# EAGLE design PCB-PAYLOAD_FINAL (EAGLE 7.6.0)
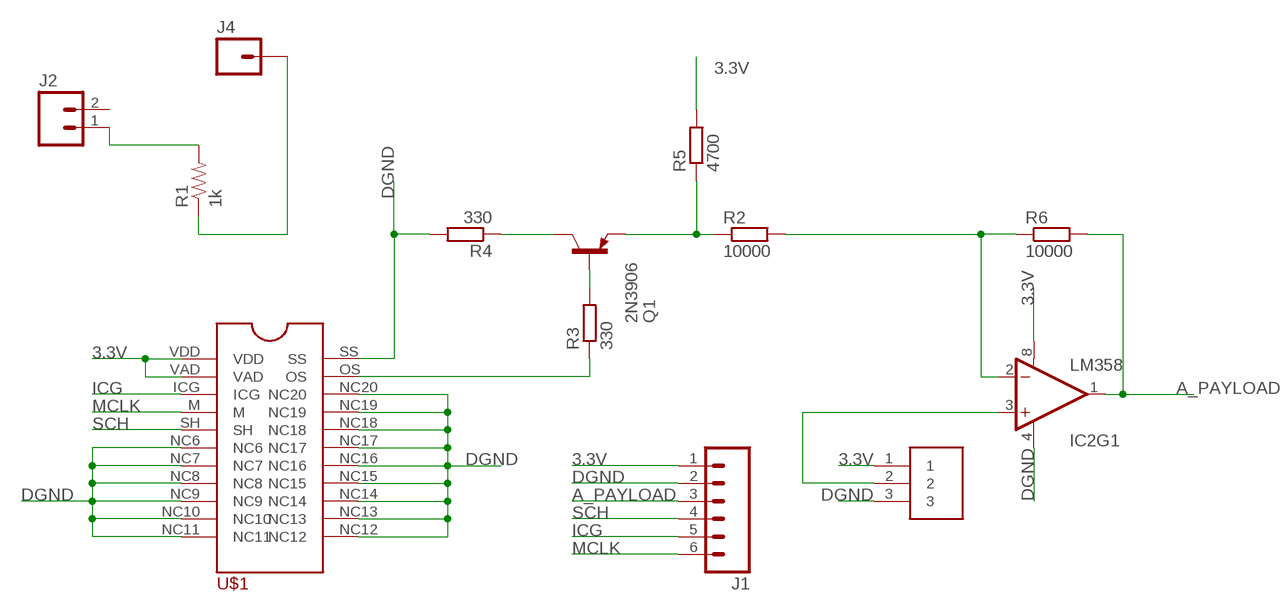
[diagram p0: schematic, sheet 1]

## Parts
IC2  LM358  [DIP08]
J1  M06SILK_FEMALE_PTH  [1X06]
J2  M02PTH  [1X02]
J4  M01PTH  [1X01]
Q1  2N3906  [TO92]
R1  1k  1KOHM-1/4W-5%(PTH)  [AXIAL-0.3]
R2  10000  R-EU_0204/5  [0204/5]
R3  330  R-EU_0204/5  [0204/5]
R4  330  R-EU_0204/5  [0204/5]
R5  4700  R-EU_0204/5  [0204/5]
R6  10000  R-EU_0204/5  [0204/5]
U$1  CCD  [CCD]
U$2  TRIMPOT_DEVICE  [TRIM_POT_PACKAGE]

## Nets
3.3V: IC2.8(V+) J1.1 R5.2 U$1.VAD U$1.VDD U$2.1
A_PAYLOAD: IC2.1(OUT) J1.3 R6.2
DGND: IC2.4(V-) J1.2 R4.2 U$1.NC6 U$1.NC7 U$1.NC8 U$1.NC9 U$1.NC10 U$1.NC11 U$1.NC12 U$1.NC13 U$1.NC14 U$1.NC15 U$1.NC16 U$1.NC17 U$1.NC18 U$1.NC19 U$1.NC20 U$1.SS U$2.3
ICG: J1.5 U$1.ICG
MCLK: J1.6 U$1.M
N$1: Q1.1(C) R4.1
N$2: R3.1 U$1.OS
N$3: IC2.2(-IN) R2.2 R6.1
N$4: Q1.2(B) R3.2
N$5: Q1.3(E) R2.1 R5.1
N$6: J4.1 R1.P$1
N$7: IC2.3(+IN) U$2.2
N$8: J2.1 R1.P$2
SCH: J1.4 U$1.SH
Unconnected: IC2.5(+IN) IC2.6(-IN) IC2.7(OUT) J2.2

## Library data of the parts
IC2 = SparkFun-AnalogIC:LM358: Jellybean op-amp; PROD_ID: IC-09172
J1 = SparkFun-Connectors:M06: Header 6 Standard 6-pin 0.1" header. Use with straight break away headers (SKU : PRT-00116), right angle break away headers (PRT-00553), swiss pins (PRT-00743), machine pins (PRT-00117), and female headers (PRT-00115). Molex polarized connector foot print use with SKU : PRT-08094 with associated crimp pins and housings. NOTES ON THE VARIANTS LOCK and LOCK_LONGPADS... This footprint was designed to help hold the alignment of a through-hole component (i.e. 6-pin header) while soldering it into place. You may notice that each hole has been shifted either up or down by 0.005 of an inch from it's more standard position (which is a perfectly straight line). This slight alteration caused the pins (the squares in the middle) to touch the edges of the holes. Because they are alternating, it causes a "brace" to hold the component in place. 0.005 has proven to be the perfect amount of "off-center" position when using our standard breakaway headers. Although looks a little odd when you look at the bare footprint, once you have a header in there, the alteration is very hard to notice. Also,if you push a header all the way into place, it is covered up entirely on the bottom side. This idea of altering the position of holes to aid alignment will be further integrated into the Sparkfun Library for other footprints. It can help hold any component with 3 or more connection pins.; PROD_ID: CONN-08437
J2 = SparkFun-Connectors:M02: Standard 2-pin 0.1" header. Use with - straight break away headers ( PRT-00116) - right angle break away headers (PRT-00553) - swiss pins (PRT-00743) - machine pins (PRT-00117) - female headers (PRT-00115) Molex polarized connector foot print use with: PRT-08233 with associated crimp pins and housings. 2.54_SCREWTERM for use with PRT-10571. 3.5mm Screw Terminal footprints for PRT-08084 5mm Screw Terminal footprints for use with PRT-08432
J4 = SparkFun-Connectors:M01: Header 1 Standard 1-pin 0.1" header. Use with straight break away headers (SKU : PRT-00116), right angle break away headers (PRT-00553), swiss pins (PRT-00743), machine pins (PRT-00117), and female headers (PRT-00115). SMTSO-256-ET is a "flush mount" nut for a 4-40 screw. The older package used to be too tight, and did not allow it to sit properly thru the drill hit. The latest (0.165DIA) fits nice and snug.
Q1 = transistor-pnp:2N3906: PNP Transistor
R1 = SparkFun-Resistors:1KOHM-1/4W-5%(PTH): RES-08380; PROD_ID: RES-08380
R2-R6 = resistor:R-EU_: RESISTOR, European symbol
U$1 = CCD:CCD
U$2 = TRIMPOT_2Kohm:TRIMPOT_DEVICE

## Board
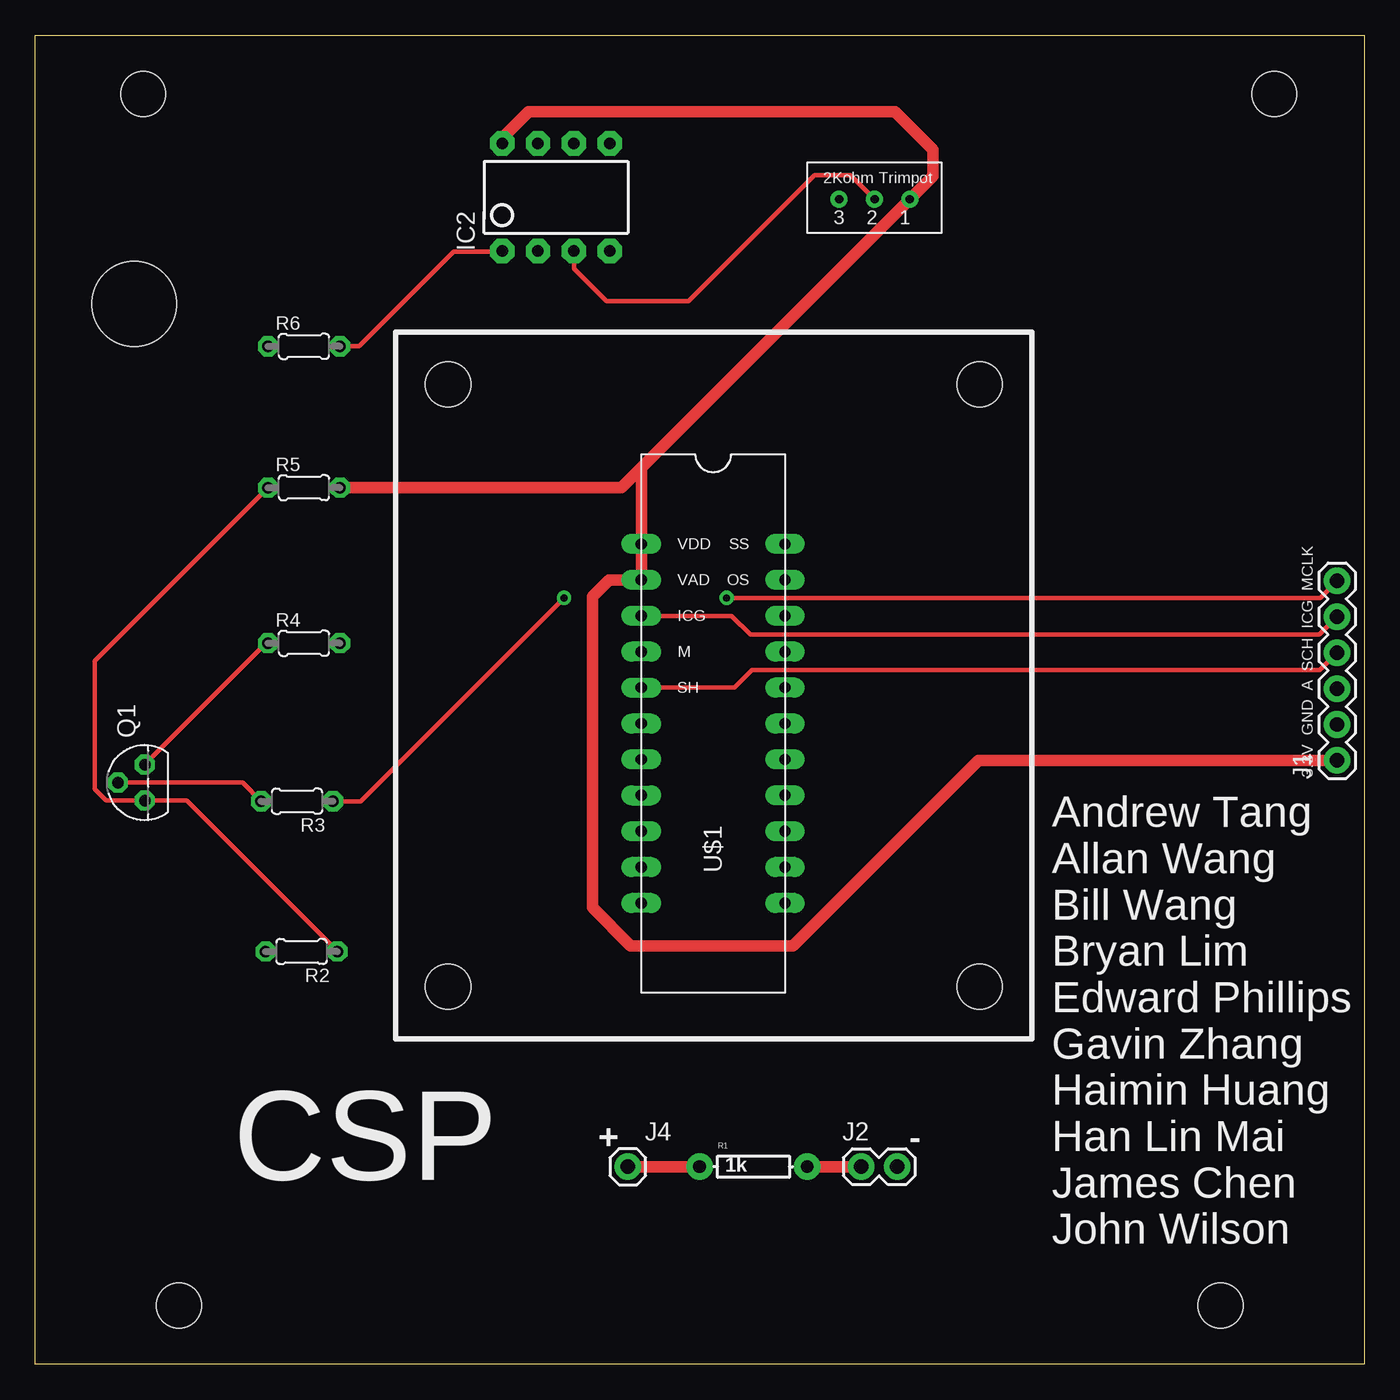
[diagram p1: board, top side]
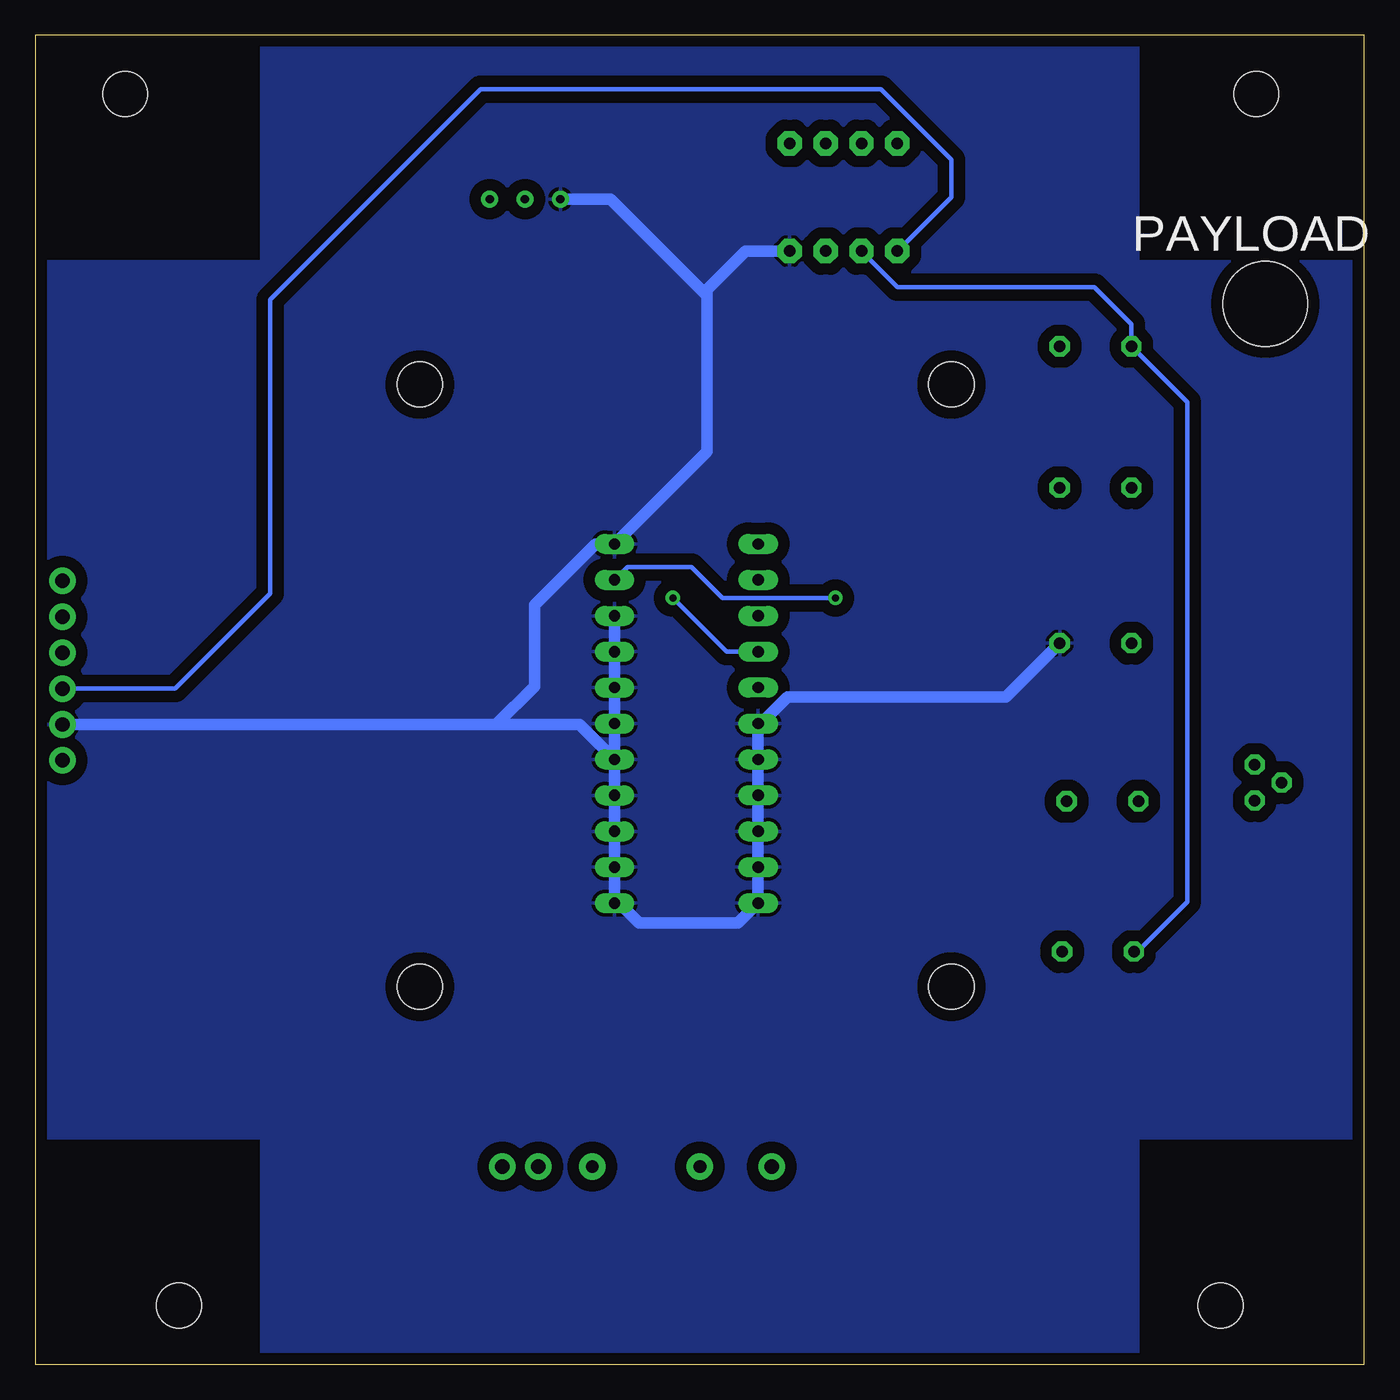
[diagram p2: board, bottom side, seen from below]

Size 94 x 94 mm. Coordinates in mm from the lower left corner, seen from the top.
Outline: 0,0 0,94 94,94 94,0 0,0
Copper layers (1*16): Top 0.035mm / dielectric 1.5mm / Bottom 0.035mm
Design rules "SparkFun": minimum track width 8mil, minimum drill 20mil, track to track 8mil, track to pad 8mil, pad to pad 8mil, via to via 8mil, smd to smd 8mil, copper to edge 8mil, drill to drill 8mil, minimum pad ring 12mil, minimum via ring 10mil, stop-mask expansion 4mil, vias tented up to drill 20mil, thermal gap 10mil
Holes 3.18 mm at 7.63,89.86 87.64,89.86 83.83,4.13 10.17,4.13
Holes 3.2 mm at 29.2,26.7 66.8,26.7 66.8,69.3 29.2,69.3
Holes 6 mm at 7,75

### Footprints (pad centres in the part's own frame; a part is rotated, then mirrored left to right if it is on the bottom)
DIP08 = drill 0.813 pad 1.727 octagon: 1 -3.81,-3.81; 2 -1.27,-3.81; 3 1.27,-3.81; 4 3.81,-3.81; 5 3.81,3.81; 6 1.27,3.81; 7 -1.27,3.81; 8 -3.81,3.81
1X06 = drill 1.016 pad 1.88: 1 0,0; 2 2.54,0; 3 5.08,0; 4 7.62,0; 5 10.16,0; 6 12.7,0
1X02 = drill 1.016 pad 1.88: 1 0,0; 2 2.54,0
1X01 = drill 1.016 pad 1.88: 1 0,0
TO92 = drill 0.813 octagon: 1 1.27,0; 2 0,1.905; 3 -1.27,0
AXIAL-0.3 = drill 0.9 pad 1.88: P$1 -3.81,0; P$2 3.81,0
0204/5 = drill 0.813 octagon: 1 -2.54,0; 2 2.54,0
CCD = drill 0.8 long: ICG -5.08,7.62; M -5.08,5.08; NC6 -5.08,0; NC7 -5.08,-2.54; NC8 -5.08,-5.08; NC9 -5.08,-7.62; NC10 -5.08,-10.16; NC11 -5.08,-12.7; NC12 5.08,-12.7; NC13 5.08,-10.16; NC14 5.08,-7.62; NC15 5.08,-5.08; NC16 5.08,-2.54; NC17 5.08,0; NC18 5.08,2.54; NC19 5.08,5.08; NC20 5.08,7.62; OS 5.08,10.16; SH -5.08,2.54; SS 5.08,12.7; VAD -5.08,10.16; VDD -5.08,12.7
TRIM_POT_PACKAGE = drill 0.6: 1 7.25,2.4; 2 4.75,2.4; 3 2.25,2.4

### Placement (x,y rotation side)
IC2  36.83,82.55 0 top
J1  92.09,42.71 90 top
J2  58.42,13.97 0 top
J4  41.91,13.97 0 top
Q1  7.74,41.14 90 top
R1  50.8,13.97 0 top
R2  18.83,29.19 180 top
R3  18.51,39.82 180 top
R4  19,51 0 top
R5  19,62 0 top
R6  19,72 0 top
U$1  47.95,45.32 0 top
U$2  54.61,80.01 0 top

### Tracks (layer width: path | path; a pad name or v marks a point on that pad's centre or on a via)
3.3V
  Top 0.813: J1.1 66.71,42.71 53.6,29.6 42.1,29.6 39.4,32.3 39.4,54.3 40.58,55.48 U$1.VAD U$1.VDD 42.87,63.42 | IC2.8 33.02,86.72 34.9,88.6 60.8,88.6 63.5,85.9 63.5,84.05 U$2.1 42.87,63.42 | R5.2 41.45,62 42.87,63.42
A_PAYLOAD
  Top 0.305: R6.2 22.9,72 29.6,78.7 32.98,78.7 IC2.1
  Bottom 0.305: J1.3 84.11,47.79 77.4,54.5 77.4,75.3 62.5,90.2 34.2,90.2 29.2,85.2 29.2,82.56 IC2.1
DGND
  Bottom 0.813: J1.2 61.4,45.25 | 61.4,45.25 55.5,45.25 U$1.NC16 | U$1.NC16 U$1.NC12 52.72,32.62 51.3,31.2 44.29,31.2 U$1.NC11 U$1.NC6 42.68,45.32 40.8,47.2 25.34,47.2 R4.2 | U$1.NC16 U$1.NC20 | 61.4,45.25 58.7,47.95 58.7,53.7 54.38,58.02 U$1.SS 46.5,64.55 46.5,75.6 | IC2.4 43.76,78.74 46.5,76 46.5,75.6 | U$2.3 53.31,82.41 46.5,75.6
  pour Bottom (isolate 0.813): 0,78 16,78 16,94 78,94 78,78 94,78 94,16 78,16 78,0 16,0 16,16 0,16
ICG
  Top 0.305: U$1.ICG 49.26,52.94 50.6,51.6 90.82,51.6 J1.5
MCLK  (via drill 0.51)
  Top 0.305: v48.9,54.2 90.88,54.2 J1.6
  Bottom 0.305: U$1.M 45.1,50.4 v48.9,54.2
N$1
  Top 0.305: Q1.1 16.33,51 R4.1
N$2  (via drill 0.51)
  Top 0.305: R3.1 23.02,39.82 v37.4,54.2
  Bottom 0.305: v37.4,54.2 45.4,54.2 47.6,56.4 52.11,56.4 U$1.OS
N$3
  Bottom 0.305: R2.2 16.01,29.19 12.5,32.7 12.5,68.04 R6.1 16.46,73.56 19.1,76.2 33.02,76.2 IC2.2
N$4
  Top 0.305: Q1.2 14.65,41.14 R3.2
N$5
  Top 0.305: R5.1 4.2,49.74 4.2,40.7 5.03,39.87 Q1.3 10.69,39.87 R2.1
N$6
  Top 0.813: J4.1 R1.P$1
N$7
  Top 0.305: IC2.3 38.1,77.5 40.4,75.2 46.2,75.2 55.1,84.1 57.67,84.1 U$2.2
N$8
  Top 0.813: R1.P$2 J2.1
SCH
  Top 0.305: U$1.SH 49.46,47.86 50.7,49.1 90.86,49.1 J1.4

### Text on the board
tPlace: 3.3V GND A SCH ICG MCLK | + | - | CSP | Andrew Tang / Allan Wang / Bill Wang / Bryan Lim / Edward Phillips / Gavin Zhang / Haimin Huang / Han Lin Mai / James Chen / John Wilson
bPlace: PAYLOAD